# Altium project G030C8T6开发板.PrjPCB
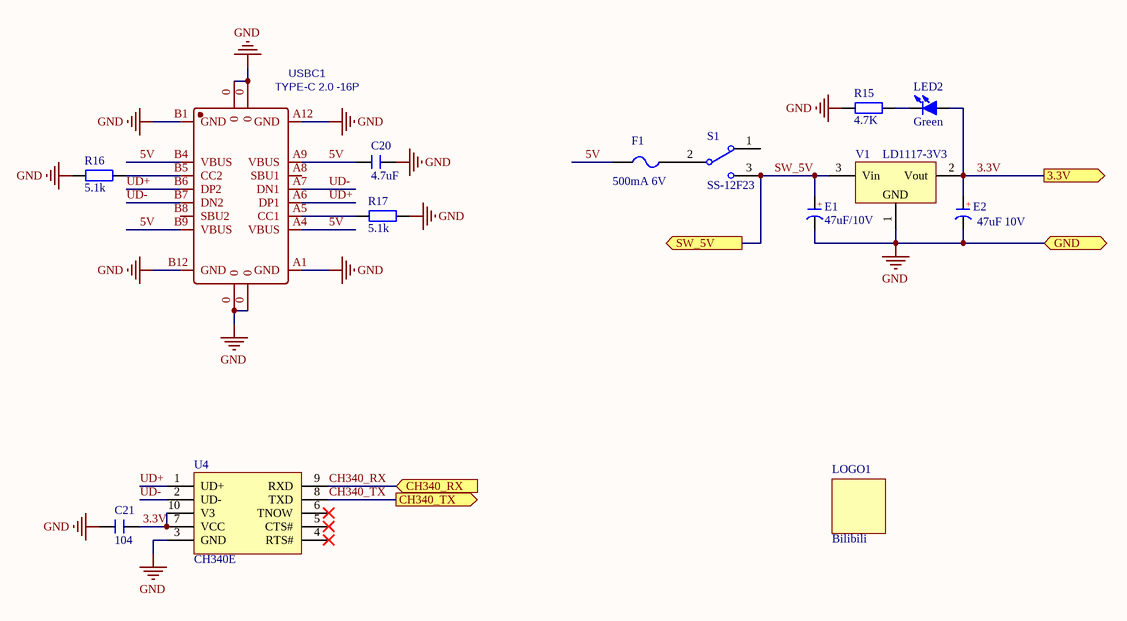
[diagram p0: USB_POWER.SchDoc]
1 sheet, 14 parts. Net scope: flat (ports and power ports of the same name join across sheets).
Board file: PCB1.PcbDoc

## Sheet USB_POWER.SchDoc
size A4

### Parts
C20  4.7uF  [C 0603_L]
C21  104  [C 0603_L]
E1  47uF/10V  [CM B(4*5.4)]
E2  47uF 10V  [CM B(4*5.4)]
F1  500mA 6V  [R 0603-HP_L]
LED2  Green  [LED_0603]
LOGO1  Bilibili  [Bilibili]
R15  4.7K  [R 0603_L]
R16  5.1k  [R 0603_L]
R17  5.1k  [R 0603_L]
S1  SS-12F23  [MSK-12C01-07]
U4  CH340E  [MSOP10_L]
USBC1  TYPE-C 2.0 -16P  [USB-C-SMD_TYPE-C-USB-5]
V1  LD1117-3V3  [SOT223_L]

### Ports
3.3V (out), CH340_RX (in), CH340_TX (out), GND, SW_5V (out)

### Nets
GND: C20.2 C21.2 E1.2(K) E2.2(K) R15.2 R16.2 R17.1 U4.3(GND) USBC1.0 USBC1.A1(GND) USBC1.A12(GND) USBC1.B1(GND) USBC1.B12(GND) V1.1(GND) ; port GND
3.3V: C21.1 E2.1(A) LED2.1(A) U4.7(VCC) U4.10(V3) V1.2(Vout) ; port 3.3V
5V: C20.1 F1.1 USBC1.A4(VBUS) USBC1.A9(VBUS) USBC1.B4(VBUS) USBC1.B9(VBUS)
CH340_RX: U4.9(RXD) ; port CH340_RX
CH340_TX: U4.8(TXD) ; port CH340_TX
SW_5V: E1.1(A) S1.3 V1.3(Vin) ; port SW_5V
UD+: U4.1(UD+) USBC1.A6(DP1) USBC1.B6(DP2)
UD-: U4.2(UD-) USBC1.A7(DN1) USBC1.B7(DN2)
NetF1_2: F1.2 S1.2
NetLED2_2: LED2.2(K) R15.1
NetR16_1: R16.1 USBC1.B5(CC2)
NetR17_2: R17.2 USBC1.A5(CC1)

Not connected (* = marked no-connect by the designer): S1 1; U4 4(RTS#)* 5(CTS#)* 6(TNOW)*; USBC1 A8(SBU1) B8(SBU2)

### Notes on the sheet
- (in symbol CE_SMD) +

### Library data of the parts
C20 C21 = C: 贴片电容; BOM名称: 无极性贴片电容; 优秀评价可免费更新: 联系淘宝ID：黄晶宝石，获取更新版封装库; 卖家免费技术支持，联系售后: 唯一出售店铺网址https://shop463601444.taobao.com; 本封装库来自淘宝卖家 ID：黄晶宝石: 其他店铺购入均为盗版，请立即申请退款
E1 E2 = CE_SMD: 贴片电解电容; 优秀评价可免费更新: 联系淘宝ID：黄晶宝石，获取更新版封装库; 卖家免费技术支持，联系售后: 唯一出售店铺网址https://shop463601444.taobao.com; 本封装库来自淘宝卖家 ID：黄晶宝石: 其他店铺购入均为盗版，请立即申请退款; BOM名称: 贴片电解电容
F1 = FU: 贴片保险丝; 版权归属: 封装库来自淘宝卖家 ID：黄晶宝石; 优秀评价可免费更新: 联系淘宝ID：黄晶宝石，获取更新版封装库; 卖家免费技术支持，联系售后: 唯一出售店铺网址https://shop463601444.taobao.com; 封装库来自淘宝卖家 ID：黄晶宝石: 其他店铺购入均为盗版，请立即申请退款; BOM名称: 贴片保险丝
LED2 = LED-SMD: 贴片LED; 优秀评价可免费更新: 联系淘宝ID：黄晶宝石，获取更新版封装库; 卖家免费技术支持，联系售后: 唯一出售店铺网址https://shop463601444.taobao.com; 封装库来自淘宝卖家 ID：黄晶宝石: 其他店铺购入均为假冒，请立即申请退款，本店奖励2~5元现金; BOM名称: 贴片LED
LOGO1 = LOGO
R15-R17 = R: 贴片电阻; 优秀评价可免费更新: 联系淘宝ID：黄晶宝石，获取更新版封装库; 卖家免费技术支持，联系售后: 唯一出售店铺网址https://shop463601444.taobao.com; 本封装库来自淘宝卖家 ID：黄晶宝石: 其他店铺购入均为盗版，请立即申请退款; BOM名称: 贴片电阻
S1 = SSW-1P: 1路波动开关; BOM名称: 波动开关; 版权归属: 封装库来自淘宝 ID：黄晶宝石; 优秀评价可免费更新: 联系淘宝ID：黄晶宝石，获取更新版封装库; 卖家免费技术支持，联系售后: 唯一出售店铺网址https://shop463601444.taobao.com; 本封装库来自淘宝卖家 ID：黄晶宝石: 其他店铺购入均为盗版，请立即申请退款
USBC1 = USB2.0 Type-C 16Pin母座: USB2.0 Type-C 母座 16Pin; BOM_Manufacturer: LCSC; BOM_Supplier: LCSC; BOM_Manufacturer Part: -; spicePre: U; spiceSymbolName: TYPE-C 3.1 -16P_C168689
V1 = LD1117: 三端稳压芯片; BOM名称: 稳压芯片; 优秀评价可免费更新: 联系淘宝ID：黄晶宝石，获取更新版封装库; 卖家免费技术支持，联系售后: 唯一出售店铺网址https://shop463601444.taobao.com; 封装库来自淘宝卖家 ID：黄晶宝石: 其他店铺购入均为假冒，请立即申请退款，本店奖励2~5元现金